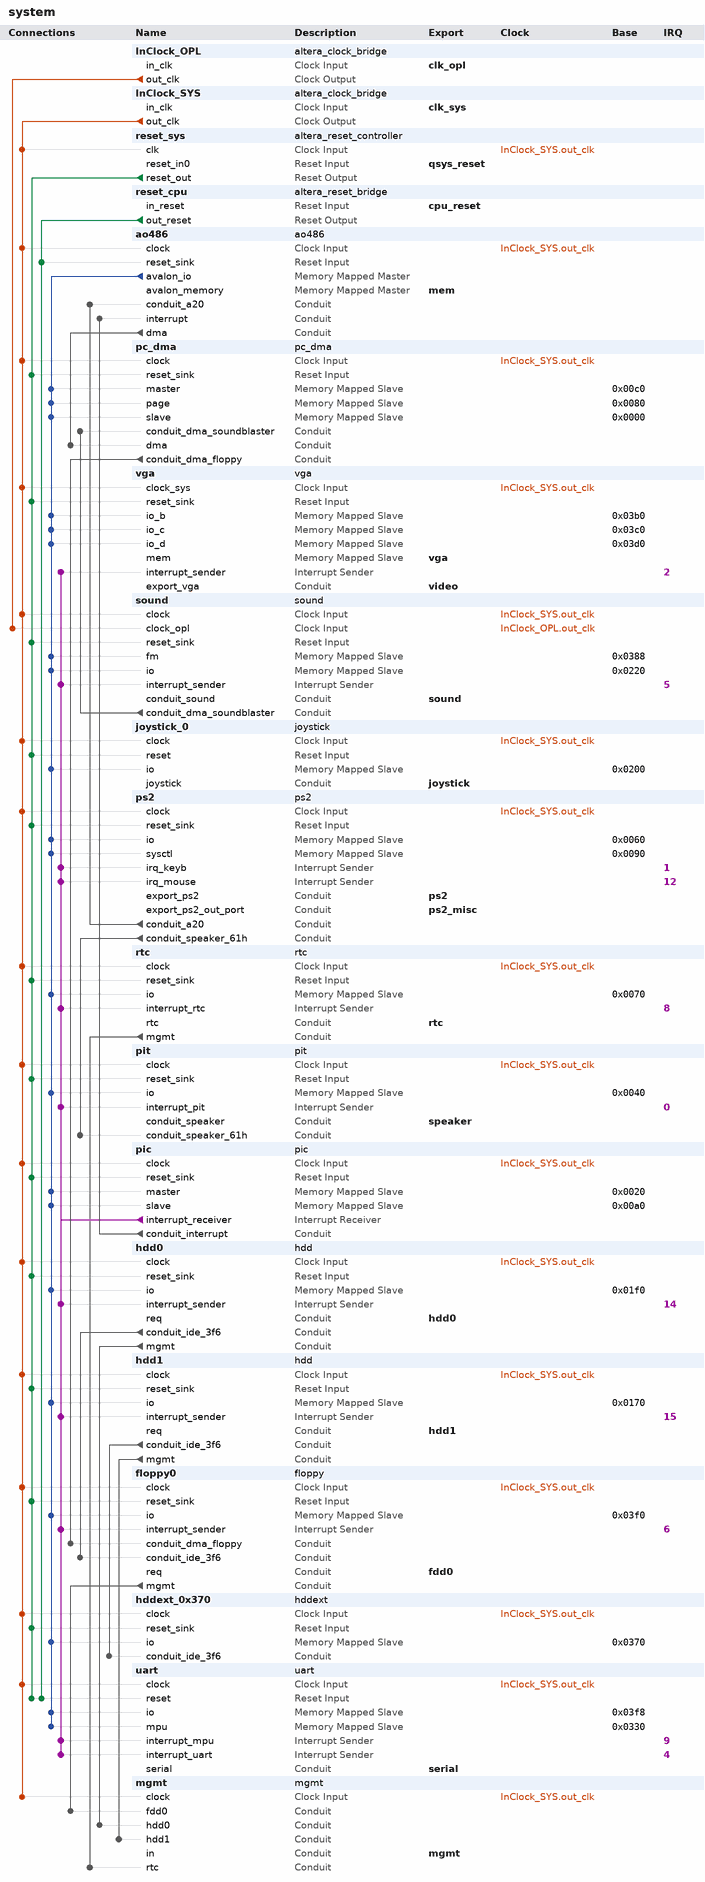
[diagram p0: system contents]
# Platform Designer (Qsys) system system, Cyclone V 5CSEBA6U23I7
# Parameters at their usual value, and those the tool derives, are not listed.
package require -exact qsys 17.0
create_system system
set_project_property DEVICE_FAMILY {Cyclone V}
set_project_property DEVICE 5CSEBA6U23I7

add_instance InClock_OPL altera_clock_bridge 17.0
set_instance_parameter_value InClock_OPL DERIVED_CLOCK_RATE 0
set_instance_parameter_value InClock_OPL EXPLICIT_CLOCK_RATE 50000000

add_instance InClock_SYS altera_clock_bridge 17.0
set_instance_parameter_value InClock_SYS DERIVED_CLOCK_RATE 0
set_instance_parameter_value InClock_SYS EXPLICIT_CLOCK_RATE 90500000

add_instance reset_sys altera_reset_controller 17.0
set_instance_parameter_value reset_sys NUM_RESET_INPUTS 1
set_instance_parameter_value reset_sys SYNC_DEPTH 2

add_instance reset_cpu altera_reset_bridge 17.0
set_instance_parameter_value reset_cpu ACTIVE_LOW_RESET 0
set_instance_parameter_value reset_cpu SYNCHRONOUS_EDGES none

add_instance ao486 ao486 1.0

add_instance pc_dma pc_dma 1.0

add_instance vga vga 1.0

add_instance sound sound 1.0

add_instance joystick_0 joystick 1.0

add_instance ps2 ps2 1.0

add_instance rtc rtc 1.0

add_instance pit pit 1.0

add_instance pic pic 1.0

add_instance hdd0 hdd 1.0

add_instance hdd1 hdd 1.0

add_instance floppy0 floppy 1.0

add_instance hddext_0x370 hddext 1.0

add_instance uart uart 17.0

add_instance mgmt mgmt 17.0

# connections
add_connection InClock_OPL.out_clk sound.clock_opl clock
add_connection InClock_SYS.out_clk ao486.clock clock
add_connection InClock_SYS.out_clk floppy0.clock clock
add_connection InClock_SYS.out_clk hdd0.clock clock
add_connection InClock_SYS.out_clk hdd1.clock clock
add_connection InClock_SYS.out_clk hddext_0x370.clock clock
add_connection InClock_SYS.out_clk joystick_0.clock clock
add_connection InClock_SYS.out_clk mgmt.clock clock
add_connection InClock_SYS.out_clk pc_dma.clock clock
add_connection InClock_SYS.out_clk pic.clock clock
add_connection InClock_SYS.out_clk pit.clock clock
add_connection InClock_SYS.out_clk ps2.clock clock
add_connection InClock_SYS.out_clk reset_sys.clk clock
add_connection InClock_SYS.out_clk rtc.clock clock
add_connection InClock_SYS.out_clk sound.clock clock
add_connection InClock_SYS.out_clk uart.clock clock
add_connection InClock_SYS.out_clk vga.clock_sys clock
add_connection reset_cpu.out_reset ao486.reset_sink reset
add_connection reset_cpu.out_reset uart.reset reset
add_connection reset_sys.reset_out floppy0.reset_sink reset
add_connection reset_sys.reset_out hdd0.reset_sink reset
add_connection reset_sys.reset_out hdd1.reset_sink reset
add_connection reset_sys.reset_out hddext_0x370.reset_sink reset
add_connection reset_sys.reset_out joystick_0.reset reset
add_connection reset_sys.reset_out pc_dma.reset_sink reset
add_connection reset_sys.reset_out pic.reset_sink reset
add_connection reset_sys.reset_out pit.reset_sink reset
add_connection reset_sys.reset_out ps2.reset_sink reset
add_connection reset_sys.reset_out rtc.reset_sink reset
add_connection reset_sys.reset_out sound.reset_sink reset
add_connection reset_sys.reset_out uart.reset reset
add_connection reset_sys.reset_out vga.reset_sink reset
add_connection ao486.avalon_io floppy0.io avalon
set_connection_parameter_value ao486.avalon_io/floppy0.io baseAddress 0x03f0
add_connection ao486.avalon_io hdd0.io avalon
set_connection_parameter_value ao486.avalon_io/hdd0.io baseAddress 0x01f0
add_connection ao486.avalon_io hdd1.io avalon
set_connection_parameter_value ao486.avalon_io/hdd1.io baseAddress 0x0170
add_connection ao486.avalon_io hddext_0x370.io avalon
set_connection_parameter_value ao486.avalon_io/hddext_0x370.io baseAddress 0x0370
add_connection ao486.avalon_io joystick_0.io avalon
set_connection_parameter_value ao486.avalon_io/joystick_0.io baseAddress 0x0200
add_connection ao486.avalon_io pc_dma.master avalon
set_connection_parameter_value ao486.avalon_io/pc_dma.master baseAddress 0x00c0
add_connection ao486.avalon_io pc_dma.page avalon
set_connection_parameter_value ao486.avalon_io/pc_dma.page baseAddress 0x0080
add_connection ao486.avalon_io pc_dma.slave avalon
set_connection_parameter_value ao486.avalon_io/pc_dma.slave baseAddress 0x0000
add_connection ao486.avalon_io pic.master avalon
set_connection_parameter_value ao486.avalon_io/pic.master baseAddress 0x0020
add_connection ao486.avalon_io pic.slave avalon
set_connection_parameter_value ao486.avalon_io/pic.slave baseAddress 0x00a0
add_connection ao486.avalon_io pit.io avalon
set_connection_parameter_value ao486.avalon_io/pit.io baseAddress 0x0040
add_connection ao486.avalon_io ps2.io avalon
set_connection_parameter_value ao486.avalon_io/ps2.io baseAddress 0x0060
add_connection ao486.avalon_io ps2.sysctl avalon
set_connection_parameter_value ao486.avalon_io/ps2.sysctl baseAddress 0x0090
add_connection ao486.avalon_io rtc.io avalon
set_connection_parameter_value ao486.avalon_io/rtc.io baseAddress 0x0070
add_connection ao486.avalon_io sound.fm avalon
set_connection_parameter_value ao486.avalon_io/sound.fm baseAddress 0x0388
add_connection ao486.avalon_io sound.io avalon
set_connection_parameter_value ao486.avalon_io/sound.io baseAddress 0x0220
add_connection ao486.avalon_io uart.io avalon
set_connection_parameter_value ao486.avalon_io/uart.io baseAddress 0x03f8
add_connection ao486.avalon_io uart.mpu avalon
set_connection_parameter_value ao486.avalon_io/uart.mpu baseAddress 0x0330
add_connection ao486.avalon_io vga.io_b avalon
set_connection_parameter_value ao486.avalon_io/vga.io_b baseAddress 0x03b0
add_connection ao486.avalon_io vga.io_c avalon
set_connection_parameter_value ao486.avalon_io/vga.io_c baseAddress 0x03c0
add_connection ao486.avalon_io vga.io_d avalon
set_connection_parameter_value ao486.avalon_io/vga.io_d baseAddress 0x03d0
add_connection ao486.dma pc_dma.dma conduit
add_connection floppy0.mgmt mgmt.fdd0 conduit
add_connection hdd0.conduit_ide_3f6 floppy0.conduit_ide_3f6 conduit
add_connection hdd0.mgmt mgmt.hdd0 conduit
add_connection hdd1.conduit_ide_3f6 hddext_0x370.conduit_ide_3f6 conduit
add_connection hdd1.mgmt mgmt.hdd1 conduit
add_connection pc_dma.conduit_dma_floppy floppy0.conduit_dma_floppy conduit
add_connection pic.conduit_interrupt ao486.interrupt conduit
add_connection ps2.conduit_a20 ao486.conduit_a20 conduit
add_connection ps2.conduit_speaker_61h pit.conduit_speaker_61h conduit
add_connection rtc.mgmt mgmt.rtc conduit
add_connection sound.conduit_dma_soundblaster pc_dma.conduit_dma_soundblaster conduit
add_connection pic.interrupt_receiver floppy0.interrupt_sender interrupt
set_connection_parameter_value pic.interrupt_receiver/floppy0.interrupt_sender irqNumber 6
add_connection pic.interrupt_receiver hdd0.interrupt_sender interrupt
set_connection_parameter_value pic.interrupt_receiver/hdd0.interrupt_sender irqNumber 14
add_connection pic.interrupt_receiver hdd1.interrupt_sender interrupt
set_connection_parameter_value pic.interrupt_receiver/hdd1.interrupt_sender irqNumber 15
add_connection pic.interrupt_receiver pit.interrupt_pit interrupt
set_connection_parameter_value pic.interrupt_receiver/pit.interrupt_pit irqNumber 0
add_connection pic.interrupt_receiver ps2.irq_keyb interrupt
set_connection_parameter_value pic.interrupt_receiver/ps2.irq_keyb irqNumber 1
add_connection pic.interrupt_receiver ps2.irq_mouse interrupt
set_connection_parameter_value pic.interrupt_receiver/ps2.irq_mouse irqNumber 12
add_connection pic.interrupt_receiver rtc.interrupt_rtc interrupt
set_connection_parameter_value pic.interrupt_receiver/rtc.interrupt_rtc irqNumber 8
add_connection pic.interrupt_receiver sound.interrupt_sender interrupt
set_connection_parameter_value pic.interrupt_receiver/sound.interrupt_sender irqNumber 5
add_connection pic.interrupt_receiver uart.interrupt_mpu interrupt
set_connection_parameter_value pic.interrupt_receiver/uart.interrupt_mpu irqNumber 9
add_connection pic.interrupt_receiver uart.interrupt_uart interrupt
set_connection_parameter_value pic.interrupt_receiver/uart.interrupt_uart irqNumber 4
add_connection pic.interrupt_receiver vga.interrupt_sender interrupt
set_connection_parameter_value pic.interrupt_receiver/vga.interrupt_sender irqNumber 2

# exported interfaces
add_interface clk_opl clock sink
set_interface_property clk_opl EXPORT_OF InClock_OPL.in_clk
add_interface clk_sys clock sink
set_interface_property clk_sys EXPORT_OF InClock_SYS.in_clk
add_interface cpu_reset reset sink
set_interface_property cpu_reset EXPORT_OF reset_cpu.in_reset
add_interface fdd0 conduit end
set_interface_property fdd0 EXPORT_OF floppy0.req
add_interface hdd0 conduit end
set_interface_property hdd0 EXPORT_OF hdd0.req
add_interface hdd1 conduit end
set_interface_property hdd1 EXPORT_OF hdd1.req
add_interface joystick conduit end
set_interface_property joystick EXPORT_OF joystick_0.joystick
add_interface mem avalon master
set_interface_property mem EXPORT_OF ao486.avalon_memory
add_interface mgmt conduit end
set_interface_property mgmt EXPORT_OF mgmt.in
add_interface ps2 conduit end
set_interface_property ps2 EXPORT_OF ps2.export_ps2
add_interface ps2_misc conduit end
set_interface_property ps2_misc EXPORT_OF ps2.export_ps2_out_port
add_interface qsys_reset reset sink
set_interface_property qsys_reset EXPORT_OF reset_sys.reset_in0
add_interface rtc conduit end
set_interface_property rtc EXPORT_OF rtc.rtc
add_interface serial conduit end
set_interface_property serial EXPORT_OF uart.serial
add_interface sound conduit end
set_interface_property sound EXPORT_OF sound.conduit_sound
add_interface speaker conduit end
set_interface_property speaker EXPORT_OF pit.conduit_speaker
add_interface vga avalon slave
set_interface_property vga EXPORT_OF vga.mem
add_interface video conduit end
set_interface_property video EXPORT_OF vga.export_vga

set_interconnect_requirement {$system} qsys_mm.clockCrossingAdapter HANDSHAKE
set_interconnect_requirement {$system} qsys_mm.maxAdditionalLatency 4

save_system system.qsys
